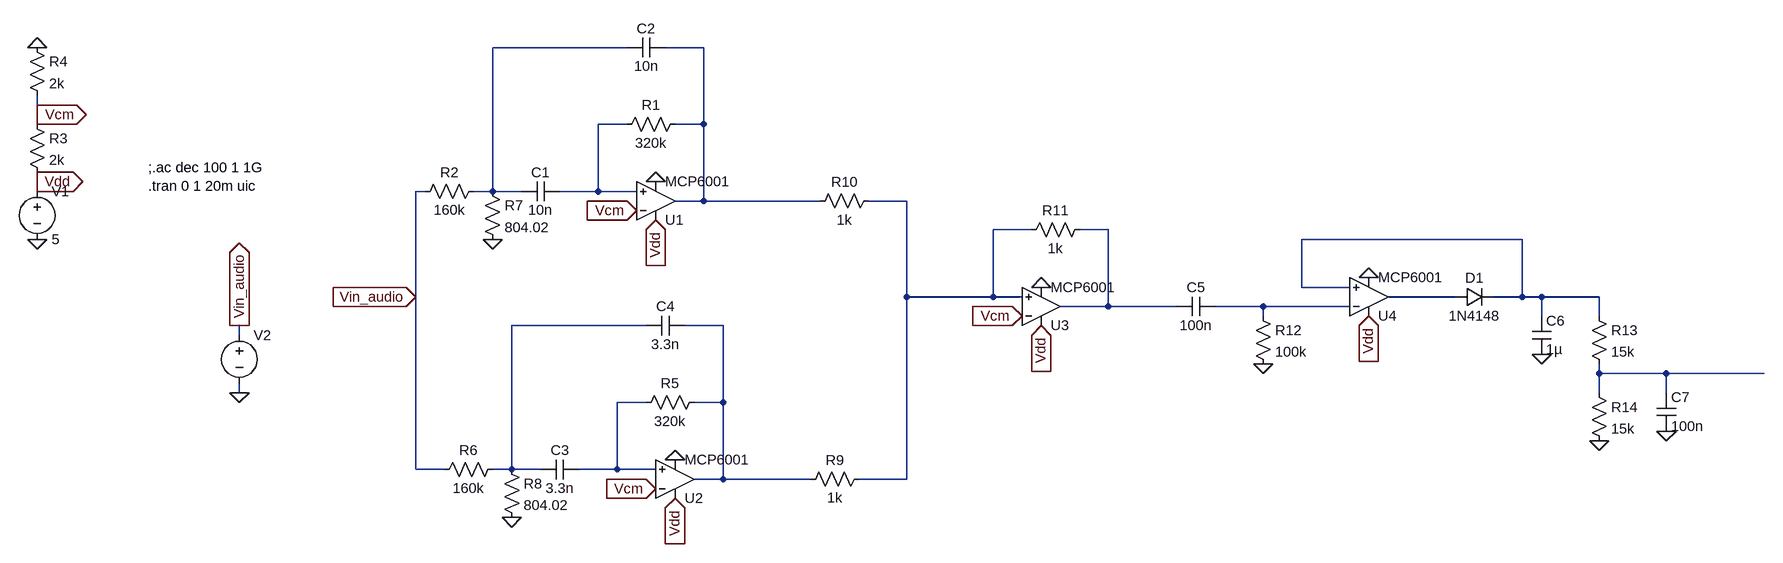
[diagram p0: schematic Exp7_final.asc]
Exp7_final.asc, the LTspice schematic file:
Version 4.1
SHEET 1 2548 680
WIRE 544 -256 320 -256
WIRE 672 -256 608 -256
WIRE -784 -144 -784 -176
WIRE -784 -128 -784 -144
WIRE 544 -128 496 -128
WIRE 672 -128 672 -256
WIRE 672 -128 624 -128
WIRE -784 -32 -784 -48
WIRE -784 -16 -784 -32
WIRE 208 -16 192 -16
WIRE 320 -16 320 -256
WIRE 320 -16 288 -16
WIRE 368 -16 320 -16
WIRE 496 -16 496 -128
WIRE 496 -16 432 -16
WIRE 560 -16 496 -16
WIRE 672 0 672 -128
WIRE 672 0 624 0
WIRE 928 0 672 0
WIRE 1072 0 1008 0
WIRE 1280 48 1216 48
WIRE 1408 48 1360 48
WIRE 2128 64 1760 64
WIRE 1760 144 1760 64
WIRE 1840 144 1760 144
WIRE 192 160 192 -16
WIRE 1072 160 1072 0
WIRE 1216 160 1216 48
WIRE 1216 160 1072 160
WIRE 1264 160 1216 160
WIRE 2016 160 1904 160
WIRE 2128 160 2128 64
WIRE 2128 160 2080 160
WIRE 2160 160 2128 160
WIRE 2256 160 2160 160
WIRE 1408 176 1408 48
WIRE 1408 176 1328 176
WIRE 1552 176 1408 176
WIRE 1696 176 1616 176
WIRE 1840 176 1696 176
WIRE 1696 192 1696 176
WIRE 2160 192 2160 160
WIRE 2256 192 2256 160
WIRE 576 208 352 208
WIRE 704 208 640 208
WIRE -112 224 -112 208
WIRE 2256 288 2256 272
WIRE 2368 288 2256 288
WIRE 2544 288 2368 288
WIRE -112 320 -112 304
WIRE 2256 320 2256 288
WIRE 2368 320 2368 288
WIRE 576 336 528 336
WIRE 704 336 704 208
WIRE 704 336 656 336
WIRE 192 448 192 160
WIRE 240 448 192 448
WIRE 352 448 352 208
WIRE 352 448 320 448
WIRE 400 448 352 448
WIRE 528 448 528 336
WIRE 528 448 464 448
WIRE 592 448 528 448
WIRE 704 464 704 336
WIRE 704 464 656 464
WIRE 912 464 704 464
WIRE 1072 464 1072 160
WIRE 1072 464 992 464
FLAG -784 64 0
FLAG -784 -256 0
FLAG -784 -32 Vdd
IOPIN -784 -32 Out
FLAG -784 -144 Vcm
IOPIN -784 -144 Out
FLAG 592 -32 0
FLAG 624 432 0
FLAG 352 528 0
FLAG 320 64 0
FLAG -112 208 Vin_audio
IOPIN -112 208 Out
FLAG -112 320 0
FLAG 192 160 Vin_audio
IOPIN 192 160 In
FLAG 560 16 Vcm
IOPIN 560 16 In
FLAG 592 480 Vcm
IOPIN 592 480 In
FLAG 624 496 Vdd
IOPIN 624 496 In
FLAG 592 32 Vdd
IOPIN 592 32 In
FLAG 1296 144 0
FLAG 1264 192 Vcm
IOPIN 1264 192 In
FLAG 1296 208 Vdd
IOPIN 1296 208 In
FLAG 1872 128 0
FLAG 1872 192 Vdd
IOPIN 1872 192 In
FLAG 1696 272 0
FLAG 2160 256 0
FLAG 2256 400 0
FLAG 2368 384 0
SYMBOL MCP6001 592 0 M180
SYMATTR InstName U1
SYMBOL res 640 -144 R90
WINDOW 0 0 56 VBottom 2
WINDOW 3 32 56 VTop 2
SYMATTR InstName R1
SYMATTR Value 320k
SYMBOL cap 432 -32 R90
WINDOW 0 0 32 VBottom 2
WINDOW 3 32 32 VTop 2
SYMATTR InstName C1
SYMATTR Value 10n
SYMBOL cap 608 -272 R90
WINDOW 0 0 32 VBottom 2
WINDOW 3 32 32 VTop 2
SYMATTR InstName C2
SYMATTR Value 10n
SYMBOL res 304 -32 R90
WINDOW 0 0 56 VBottom 2
WINDOW 3 32 56 VTop 2
SYMATTR InstName R2
SYMATTR Value 160k
SYMBOL voltage -784 -32 R0
WINDOW 123 0 0 Left 0
WINDOW 39 0 0 Left 0
SYMATTR InstName V1
SYMATTR Value 5
SYMBOL res -800 -144 R0
SYMATTR InstName R3
SYMATTR Value 2k
SYMBOL res -800 -272 R0
SYMATTR InstName R4
SYMATTR Value 2k
SYMBOL MCP6001 624 464 M180
SYMATTR InstName U2
SYMBOL res 672 320 R90
WINDOW 0 0 56 VBottom 2
WINDOW 3 32 56 VTop 2
SYMATTR InstName R5
SYMATTR Value 320k
SYMBOL cap 464 432 R90
WINDOW 0 0 32 VBottom 2
WINDOW 3 32 32 VTop 2
SYMATTR InstName C3
SYMATTR Value 3.3n
SYMBOL cap 640 192 R90
WINDOW 0 0 32 VBottom 2
WINDOW 3 32 32 VTop 2
SYMATTR InstName C4
SYMATTR Value 3.3n
SYMBOL res 336 432 R90
WINDOW 0 0 56 VBottom 2
WINDOW 3 32 56 VTop 2
SYMATTR InstName R6
SYMATTR Value 160k
SYMBOL res 304 -32 R0
SYMATTR InstName R7
SYMATTR Value 804.02
SYMBOL res 336 432 R0
SYMATTR InstName R8
SYMATTR Value 804.02
SYMBOL voltage -112 208 R0
WINDOW 3 82 38 Invisible 1
WINDOW 39 0 0 Left 0
SYMATTR Value SINE(0 0.45 3.3k)
SYMATTR InstName V2
SYMATTR Value2 AC 1 0
SYMBOL MCP6001 1296 176 M180
SYMATTR InstName U3
SYMBOL res 1008 448 R90
WINDOW 0 0 56 VBottom 2
WINDOW 3 32 56 VTop 2
SYMATTR InstName R9
SYMATTR Value 1k
SYMBOL res 1024 -16 R90
WINDOW 0 0 56 VBottom 2
WINDOW 3 32 56 VTop 2
SYMATTR InstName R10
SYMATTR Value 1k
SYMBOL res 1376 32 R90
WINDOW 0 0 56 VBottom 2
WINDOW 3 32 56 VTop 2
SYMATTR InstName R11
SYMATTR Value 1k
SYMBOL cap 1616 160 R90
WINDOW 0 0 32 VBottom 2
WINDOW 3 32 32 VTop 2
SYMATTR InstName C5
SYMATTR Value 100n
SYMBOL res 1680 176 R0
SYMATTR InstName R12
SYMATTR Value 100k
SYMBOL MCP6001 1872 160 M180
SYMATTR InstName U4
SYMBOL diode 2016 176 R270
WINDOW 0 32 32 VTop 2
WINDOW 3 0 32 VBottom 2
SYMATTR InstName D1
SYMATTR Value 1N4148
SYMBOL cap 2144 192 R0
SYMATTR InstName C6
SYMATTR Value 1µ
SYMBOL cap 2352 320 R0
SYMATTR InstName C7
SYMATTR Value 100n
SYMBOL res 2240 176 R0
SYMATTR InstName R13
SYMATTR Value 15k
SYMBOL res 2240 304 R0
SYMATTR InstName R14
SYMATTR Value 15k
TEXT -264 -56 Left 2 !;.ac dec 100 1 1G\n.tran 0 1 20m uic

The netlist it stands for:
* Exp7_final.asc
* U1: MCP6001 (symbol MCP6001 not available, pins judged from their places): In+=N003 In-=Vcm V+=Vdd V-=0 OUT=N002
R1 N002 N003 320k
C1 N003 N001 10n
C2 N002 N001 10n
R2 N001 Vin_audio 160k
V1 Vdd 0 5
R3 Vcm Vdd 2k
R4 0 Vcm 2k
* U2: MCP6001 (symbol MCP6001 not available, pins judged from their places): In+=N012 In-=Vcm V+=Vdd V-=0 OUT=N010
R5 N010 N012 320k
C3 N012 N009 3.3n
C4 N010 N009 3.3n
R6 N009 Vin_audio 160k
R7 N001 0 804.02
R8 N009 0 804.02
V2 Vin_audio 0 SINE(0 0.45 3.3k) AC 1 0
* U3: MCP6001 (symbol MCP6001 not available, pins judged from their places): In+=N004 In-=Vcm V+=Vdd V-=0 OUT=N005
R9 N004 N010 1k
R10 N004 N002 1k
R11 N005 N004 1k
C5 N008 N005 100n
R12 N008 0 100k
* U4: MCP6001 (symbol MCP6001 not available, pins judged from their places): In+=N006 In-=N008 V+=Vdd V-=0 OUT=N007
D1 N007 N006 1N4148
C6 N006 0 1µ
C7 N011 0 100n
R13 N006 N011 15k
R14 N011 0 15k
.model D D
.lib standard.dio
;.ac dec 100 1 1G
.tran 0 1 20m uic
.backanno
.end